# Altium schematic sheet EsquematicoPuerta.SchDoc
size A4
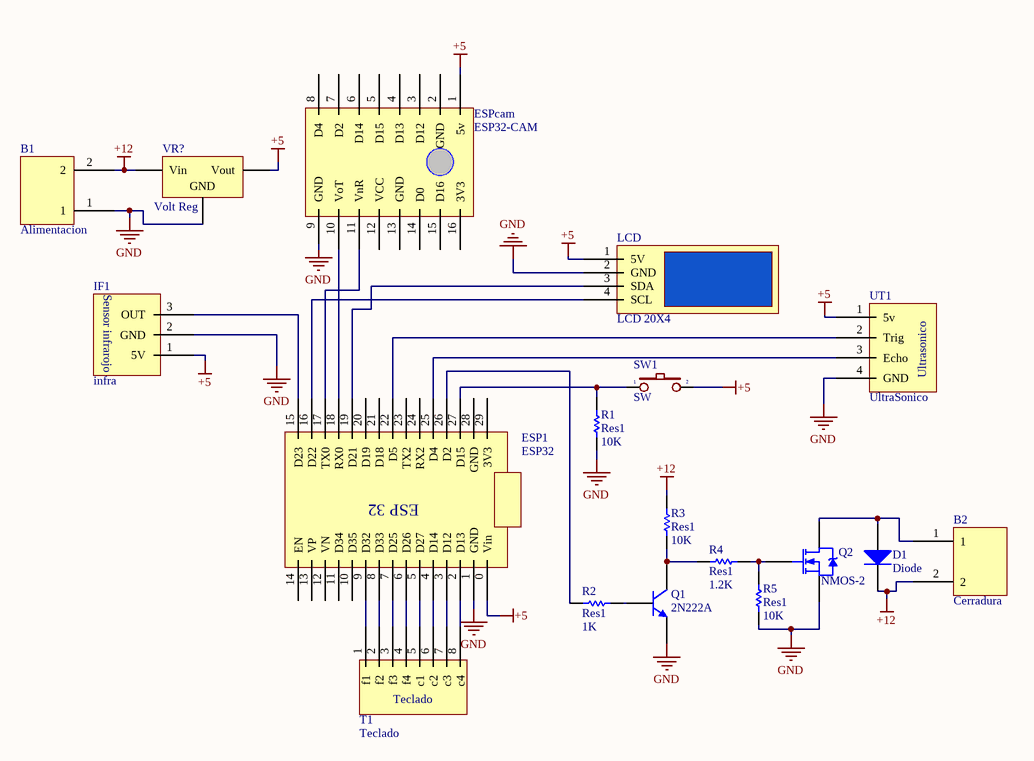
[diagram p0: EsquematicoPuerta.SchDoc]

## Parts
B1  Alimentacion  [bornera chica]
B2  Cerradura  [bornera chica]
D1  Diode  [SMC]
ESP1  ESP32  [ESP32]
ESPcam  ESP32-CAM
IF1  infra
LCD  LCD 20X4
Q1  2N222A  [TO-92A]
Q2  NMOS-2  [TO-220AB]
R1  Res1  value 10K  [AXIAL-0.3]
R2  Res1  value 1K  [AXIAL-0.3]
R3  Res1  value 10K  [AXIAL-0.3]
R4  Res1  value 1.2K  [AXIAL-0.3]
R5  Res1  value 10K  [AXIAL-0.3]
SW1  SW  [SW2]
T1  Teclado
UT1  UltraSonico
VR?  Volt Reg  [D2PAK_N]

## Nets
+5: ESP1.0(Vin) ESPcam.1(5v) IF1.1(5V) LCD.1(5V) SW1.2 UT1.1(5v) VR?.3(Vout)
+12: B1.2 B2.2 D1.2(K) R3.2 VR?.1(Vin)
GND: B1.1 ESP1.1(GND) ESPcam.9(GND) IF1.2(GND) LCD.2(GND) Q1.1(E) Q2.3(S) R1.1 R5.1 UT1.4(GND) VR?.2(GND)
NetB2_1: B2.1 D1.1(A) Q2.2(D)
NetESP1_2: ESP1.2(D13) T1.8(c4)
NetESP1_3: ESP1.3(D12) T1.7(c3)
NetESP1_4: ESP1.4(D14) T1.6(c2)
NetESP1_5: ESP1.5(D27) T1.5(c1)
NetESP1_6: ESP1.6(D26) T1.4(f4)
NetESP1_7: ESP1.7(D25) T1.3(f3)
NetESP1_8: ESP1.8(D33) T1.2(f2)
NetESP1_9: ESP1.9(D32) T1.1(f1)
NetESP1_15: ESP1.15(D23) IF1.3(OUT)
NetESP1_16: ESP1.16(D22) LCD.4(SCL)
NetESP1_17: ESP1.17(TX0) ESPcam.11(VnR)
NetESP1_18: ESP1.18(RX0) ESPcam.10(VoT)
NetESP1_19: ESP1.19(D21) LCD.3(SDA)
NetESP1_22: ESP1.22(D5) UT1.2(Trig)
NetESP1_25: ESP1.25(D4) UT1.3(Echo)
NetESP1_26: ESP1.26(D2) R2.1
NetESP1_27: ESP1.27(D15) R1.2 SW1.1
NetQ1_2: Q1.2(B) R2.2
NetQ1_3: Q1.3(C) R3.1 R4.1
NetQ2_1: Q2.1(G) R4.2 R5.2

Not connected (* = marked no-connect by the designer): ESP1 10(D35) 11(D34) 12(VN) 13(VP) 14(EN) 20(D19) 21(D18) 23(TX2) 24(RX2) 28(GND) 29(3V3); ESPcam 2(GND) 3(D12) 4(D13) 5(D15) 6(D14) 7(D2) 8(D4) 12(VCC) 13(GND) 14(D0) 15(D16) 16(3V3)

## Notes on the sheet
- (in symbol ESP32) ESP 32
- (in symbol infra) Sensor infrarojo
- (in symbol UltraSonico) Ultrasonico

## Library data of the parts
B1 B2 = bornera
D1 = Diode: Default Diode; Published: 8-Jun-2000; LatestRevisionDate: 17-Jul-2002; LatestRevisionNote: Re-released for DXP Platform.; PackageVersion: Sep-1996; PackageReference: SMC; Publisher: Altium Limited; PackageDescription: DO-214-AB/SMC; 2 C-Bend Leads; Body 7.9 x 5.9 mm, inc. leads (LxW); Code_JEDEC: DO-214-AB
Q1 = 2N3904: NPN General Purpose Amplifier; Published: 8-Jun-2000; LatestRevisionDate: 15-Jan-2003; LatestRevisionNote: PCB Footprint 'BCY-W3/D4.7' replaced; DatasheetVersion: 1997; PackageVersion: Sep-1998; PackageReference: TO-92A; Publisher: Altium Limited; PackageDescription: TO, Flat Index; 3 In-Line, Axial Leads; Body Dia. 4.5mm; Leads 0.51 x 0.48 mm (max); ComponentLink1Description: Manufacturer Link; ComponentLink1URL: http://www.fairchildsemi.com/; ComponentLink2Description: Datasheet; ComponentLink2URL: http://www.fairchildsemi.com/ds/2N%2F2N3904.pdf
Q2 = NMOS-2: N-Channel Power MOSFET; Note: Pin 2 is electrically connected to pin 4.; Published: 8-Jun-2000; LatestRevisionDate: 17-Jul-2002; LatestRevisionNote: Re-released for DXP Platform.; DatasheetVersion: PD-9.814; PackageVersion: Feb-1997; PackageReference: TO-220AB; Publisher: Altium Limited; PackageDescription: TO, Thru-Hole, Vertical, Heatsink Mounted; 3 In-Line Leads; Pitch 2.54 mm; ComponentLink1Description: Manufacturer Link; ComponentLink1URL: http://www.irf.com/
R1-R5 = Res1: Resistor; Published: 8-Jun-2000; LatestRevisionDate: 17-Jul-2002; LatestRevisionNote: Re-released for DXP Platform.; PackageReference: AXIAL-0.3; Publisher: Altium Limited; PackageDescription: Axial Device, Thru-Hole; 2 Leads; 0.3 in Pin Spacing
SW1 = SW2: Switch button 2 pin; Value: SW chip 2 pin
VR? = Volt Reg: Voltage Regulator; Published: 24-Mar-1999; LatestRevisionDate: 29-May-2009; LatestRevisionNote: IPC-7351 Footprint Added.; PackageReference: D2PAK; Publisher: Altium Limited; PackageDescription: 3-Pin Transistor Outline Package 2.54 mm Pitch, 15.1 mm Lead Span